# Altium schematic sheet PART3_Volt_Reg.SchDoc
size A4
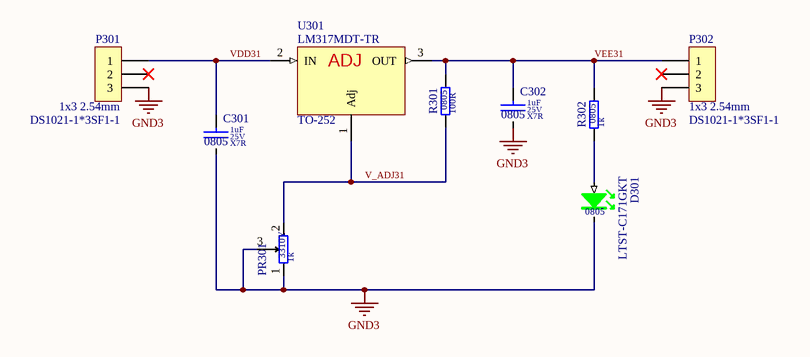
[diagram p0: PART3_Volt_Reg.SchDoc]

## Parts
C301  value 1uF  Dielectric: X7R  Voltage: 25V  SCH_Footprint: 0805  [C_0805_2012]  (hidden comment: Ceramic X7R)
C302  value 1uF  Dielectric: X7R  Voltage: 25V  SCH_Footprint: 0805  [C_0805_2012]  (hidden comment: Ceramic X7R)
D301  value LTST-C171GKT  SCH_Footprint: 0805  [OL_0805_2012]  (hidden comment: Green led)
P301  value DS1021-1*3SF1-1  SCH_Footprint: 1x3 2.54mm  [P_HEADER_1x3_2.54]  (hidden comment: Goldpin)
P302  value DS1021-1*3SF1-1  SCH_Footprint: 1x3 2.54mm  [P_HEADER_1x3_2.54]  (hidden comment: Goldpin)
PR301  value 1k  [3310Y]  (hidden comment: Resistor)
R301  value 100R  SCH_Footprint: 0805  [R_0805_2012]  (hidden comment: Resistor)
R302  value 1k  SCH_Footprint: 0805  [R_0805_2012]  (hidden comment: Resistor)
U301  value LM317MDT-TR  [TO-252]

## Nets
GND3: C301.2 C302.2 D301.1(K) P301.3 P302.3 PR301.1 PR301.3
V_ADJ31: PR301.2 R301.1 U301.1(Adj)
VDD31: C301.1 P301.1 U301.2(IN)
VEE31: C302.1 P302.1 R301.2 R302.2 U301.3(OUT)
NetD301_2: D301.2(A) R302.1

Not connected (* = marked no-connect by the designer): P301 2*; P302 2*

## Library data of the parts
C301 C302 = C_1uF_25V_X7R_0805_10: Capacitor; Manufacturer: AVX; Manufacturer Part Number: 08053C105KAT2A; Tolerance (%): 10; Part Number: C_1uF_25V_X7R_0805_10; HelpURL: https://www.tme.eu/Document/667fe6e7748c0ed1675574c6bf64b751/AVX_X7R.pdf; Supplier 1: TME; Supplier Part Number 1: 08053C105KAT2A; Supplier 2: RS Components; Supplier Part Number 2: 1351396; Supplier 3: Farnell; Supplier Part Number 3: 1658877; Supplier 4: Mouser; Supplier Part Number 4: 581-08053C105KAT2A; Supplier 5: Digi-Key; Supplier Part Number 5: 478-5030-1-ND
D301 = OL_G_0805_0C006_LTST-C171GKT: LED GREEN; Manufacturer: Lite-On; Part Number: OL_G_0805_0C006_LTST-C171GKT; HelpURL: http://datasheet.octopart.com/LTST-C171GKT-Lite-On-datasheet-158474.pdf; Manufacturer Part Number: LTST-C171GKT; Supplier 1: TME; Supplier Part Number 1: LTST-C171GKT; Supplier 2: RS Components; Supplier Part Number 2: 6920935; Supplier 3: Farnell; Supplier 4: Mouser; Supplier Part Number 4: 859-LTST-C171GKT; Supplier 5: Digi-Key; Supplier Part Number 5: 160-1423-1-ND
P301 P302 = P_HEADER_1x3_2.54: Pin Header; Manufacturer: Connfly; Part Number: P_HEADER_1x3_2.54; Component Type: Standard; HelpURL: http://www.tme.eu/en/Document/cc301e58a5da78cb543a94b5a5b7f06a/DS1021.pdf; Manufacturer Part Number: DS1021-1*3SF1-1; Supplier 1: TME; Supplier Part Number 1: ZL201-03G; Supplier 2: RS Components; Supplier 3: Farnell; Supplier 4: Mouser; Supplier 5: Digi-Key
PR301 = R_1k_3310Y_20: Manufacturer: Bourns; Manufacturer Part Number: 3310Y-001-102L; Voltage: 50V; Power: 250mW; Tolerance: 20%; SCH_Footprint: 3310Y; Part Number: R_1k_3310Y_20; HelpURL: https://docs.rs-online.com/4641/0900766b8069b9f0.pdf; Supplier 1: TME; Supplier Part Number 1: 3310Y-001-102L; Supplier 2: RS Components; Supplier Part Number 2: 522-0603P; Supplier 3: Farnell; Supplier Part Number 3: 1156139; Supplier 4: Mouser; Supplier Part Number 4: 652-3310Y-001-102L; Supplier 5: Digi-Key; Supplier Part Number 5: 3310Y-001-102L-ND
R301 = R_100R_0805_1: Manufacturer: Yageo; Manufacturer Part Number: RC0805FR-07100RL; Voltage: 150V; Power: 125mW; Tolerance: 1%; Part Number: R_100R_0805_1; HelpURL: https://www.tme.eu/pl/Document/7b8fed8c112f8a94930279c22c957f7f/rc0805yageo.pdf; Supplier 1: TME; Supplier Part Number 1: RC0805FR-07100R; Supplier 2: RS Components; Supplier Part Number 2: 618-5135; Supplier 3: Farnell; Supplier Part Number 3: 9237364; Supplier 4: Mouser; Supplier Part Number 4: 603-RC0805FR-07100RL; Supplier 5: Digi-Key; Supplier Part Number 5: 311-100CRCT-ND
R302 = R_1k_0805_1: Manufacturer: Royalohm; Manufacturer Part Number: HP05W3F1001T5E; Voltage: 150V; Power: 300mW; Tolerance: 1%; Part Number: R_1k_0805_1; HelpURL: https://www.tme.eu/pl/Document/63d5a2fbb689d2d511047d7cc8640cd8/chip_resistor_hp.pdf; Supplier 1: TME; Supplier Part Number 1: HP05-1K1%; Supplier 2: RS Components; Supplier 3: Farnell; Supplier 4: Mouser; Supplier 5: Digi-Key
U301 = VL_LM317MDT: configuration with adjust; Manufacturer: STMicroelectronics; Voltage: ADJ; Current: 1A; SCH_Footprint: TO-252; Part Number: VL_LM317MDT; HelpURL: https://datasheet.octopart.com/LM317MDT-TR-STMicroelectronics-datasheet-10674389.pdf; Manufacturer Part Number: LM317MDT-TR; Supplier 1: TME; Supplier Part Number 1: LM317MDT-TR; Supplier 2: RS Components; Supplier Part Number 2: 7140798; Supplier 3: Farnell; Supplier Part Number 3: 2296022; Supplier 4: Mouser; Supplier Part Number 4: 511-LM317MDT-TR; Supplier 5: Digi-Key; Supplier Part Number 5: 497-1574-1-ND